# EAGLE design Hornet ODU_1 (EAGLE 9.6.2)
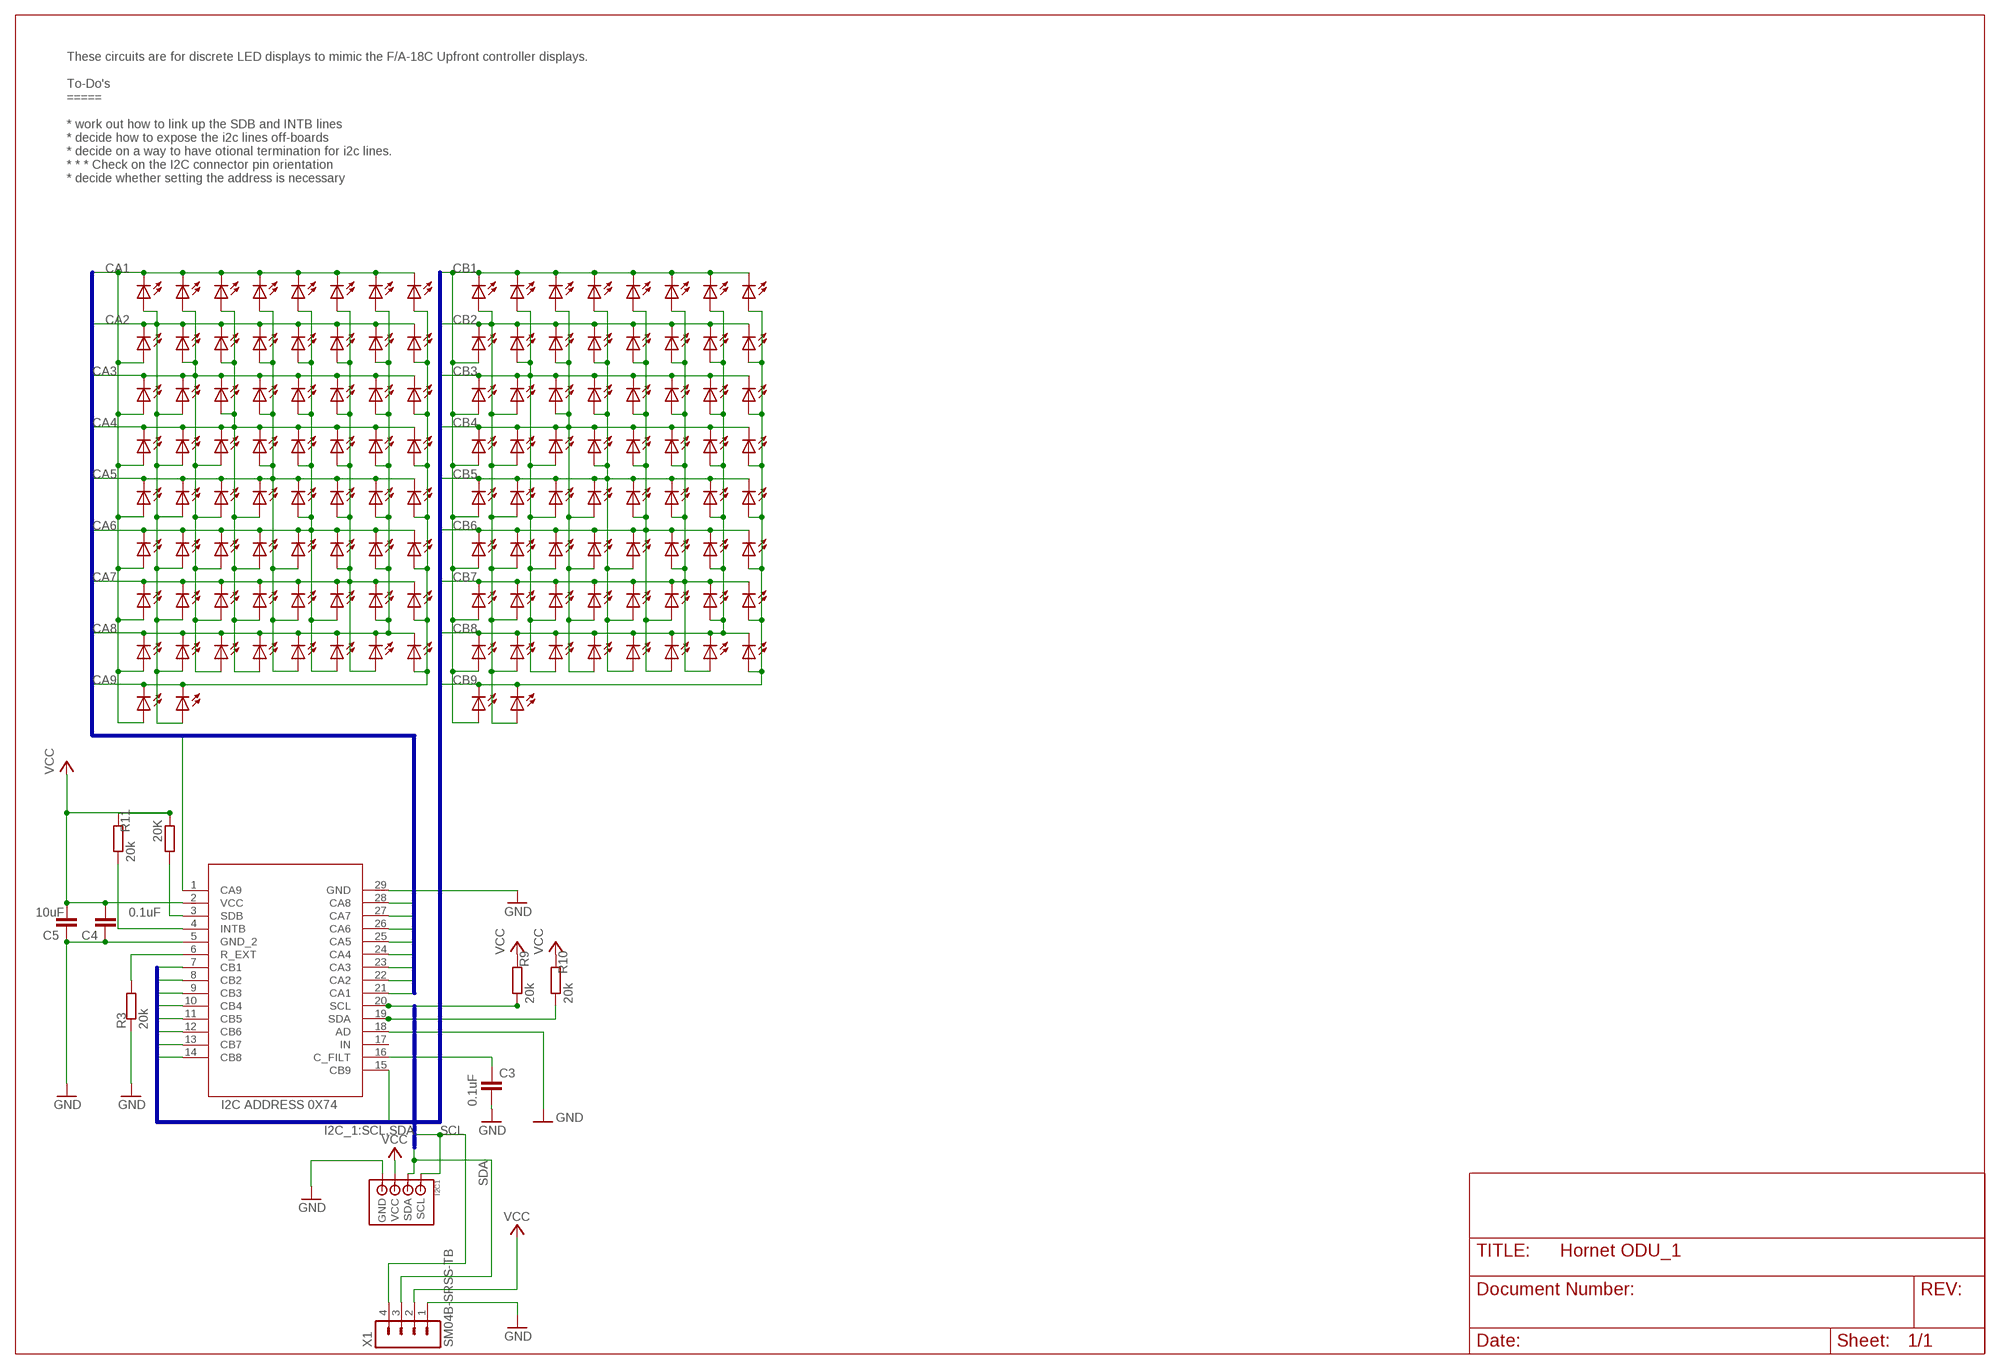
[diagram p0: schematic, sheet 1]

## Parts
C3  0.1uF  C-EUC0805  [C0805]
C4  0.1uF  C-EUC0805  [C0805]
C5  10uF  C-EUC0805  [C0805]
I2C1  I2C_STEMMA_JST_PH_CONNECTORB4B-PH_STEMMA_I2C  [B4B-PH-SOLDER]
LED_A5  LEDSMT0603_1  [CHIPLED_0603]
LED_A6  LEDSMT0603_1  [CHIPLED_0603]
LED_A7  LEDSMT0603_1  [CHIPLED_0603]
LED_A8  LEDSMT0603_1  [CHIPLED_0603]
LED_A9  LEDSMT0603_1  [CHIPLED_0603]
LED_A10  LEDSMT0603_1  [CHIPLED_0603]
LED_A11  LEDSMT0603_1  [CHIPLED_0603]
LED_A12  LEDSMT0603_1  [CHIPLED_0603]
LED_B5  LEDSMT0603_1  [CHIPLED_0603]
LED_B6  LEDSMT0603_1  [CHIPLED_0603]
LED_B7  LEDSMT0603_1  [CHIPLED_0603]
LED_B8  LEDSMT0603_1  [CHIPLED_0603]
LED_B9  LEDSMT0603_1  [CHIPLED_0603]
LED_B10  LEDSMT0603_1  [CHIPLED_0603]
LED_B11  LEDSMT0603_1  [CHIPLED_0603]
LED_B12  LEDSMT0603_1  [CHIPLED_0603]
LED_C5  LEDSMT0603_1  [CHIPLED_0603]
LED_C6  LEDSMT0603_1  [CHIPLED_0603]
LED_C7  LEDSMT0603_1  [CHIPLED_0603]
LED_C8  LEDSMT0603_1  [CHIPLED_0603]
LED_C9  LEDSMT0603_1  [CHIPLED_0603]
LED_C10  LEDSMT0603_1  [CHIPLED_0603]
LED_C11  LEDSMT0603_1  [CHIPLED_0603]
LED_C12  LEDSMT0603_1  [CHIPLED_0603]
LED_D5  LEDSMT0603_1  [CHIPLED_0603]
LED_D6  LEDSMT0603_1  [CHIPLED_0603]
LED_D7  LEDSMT0603_1  [CHIPLED_0603]
LED_D8  LEDSMT0603_1  [CHIPLED_0603]
LED_D9  LEDSMT0603_1  [CHIPLED_0603]
LED_D10  LEDSMT0603_1  [CHIPLED_0603]
LED_D11  LEDSMT0603_1  [CHIPLED_0603]
LED_D12  LEDSMT0603_1  [CHIPLED_0603]
LED_E5  LEDSMT0603_1  [CHIPLED_0603]
LED_E6  LEDSMT0603_1  [CHIPLED_0603]
LED_E7  LEDSMT0603_1  [CHIPLED_0603]
LED_E8  LEDSMT0603_1  [CHIPLED_0603]
LED_E9  LEDSMT0603_1  [CHIPLED_0603]
LED_E10  LEDSMT0603_1  [CHIPLED_0603]
LED_E11  LEDSMT0603_1  [CHIPLED_0603]
LED_E12  LEDSMT0603_1  [CHIPLED_0603]
LED_F5  LEDSMT0603_1  [CHIPLED_0603]
LED_F6  LEDSMT0603_1  [CHIPLED_0603]
LED_F7  LEDSMT0603_1  [CHIPLED_0603]
LED_F8  LEDSMT0603_1  [CHIPLED_0603]
LED_F9  LEDSMT0603_1  [CHIPLED_0603]
LED_F10  LEDSMT0603_1  [CHIPLED_0603]
LED_F11  LEDSMT0603_1  [CHIPLED_0603]
LED_F12  LEDSMT0603_1  [CHIPLED_0603]
LED_G5  LEDSMT0603_1  [CHIPLED_0603]
LED_G6  LEDSMT0603_1  [CHIPLED_0603]
LED_G7  LEDSMT0603_1  [CHIPLED_0603]
LED_G8  LEDSMT0603_1  [CHIPLED_0603]
LED_G9  LEDSMT0603_1  [CHIPLED_0603]
LED_G10  LEDSMT0603_1  [CHIPLED_0603]
LED_G11  LEDSMT0603_1  [CHIPLED_0603]
LED_G12  LEDSMT0603_1  [CHIPLED_0603]
LED_H5  LEDSMT0603_1  [CHIPLED_0603]
LED_H6  LEDSMT0603_1  [CHIPLED_0603]
LED_H7  LEDSMT0603_1  [CHIPLED_0603]
LED_H8  LEDSMT0603_1  [CHIPLED_0603]
LED_H9  LEDSMT0603_1  [CHIPLED_0603]
LED_H10  LEDSMT0603_1  [CHIPLED_0603]
LED_H11  LEDSMT0603_1  [CHIPLED_0603]
LED_H12  LEDSMT0603_1  [CHIPLED_0603]
LED_K5  LEDSMT0603_1  [CHIPLED_0603]
LED_K6  LEDSMT0603_1  [CHIPLED_0603]
LED_K7  LEDSMT0603_1  [CHIPLED_0603]
LED_K8  LEDSMT0603_1  [CHIPLED_0603]
LED_K9  LEDSMT0603_1  [CHIPLED_0603]
LED_K10  LEDSMT0603_1  [CHIPLED_0603]
LED_K11  LEDSMT0603_1  [CHIPLED_0603]
LED_K12  LEDSMT0603_1  [CHIPLED_0603]
LED_M5  LEDSMT0603_1  [CHIPLED_0603]
LED_M6  LEDSMT0603_1  [CHIPLED_0603]
LED_M7  LEDSMT0603_1  [CHIPLED_0603]
LED_M8  LEDSMT0603_1  [CHIPLED_0603]
LED_M9  LEDSMT0603_1  [CHIPLED_0603]
LED_M10  LEDSMT0603_1  [CHIPLED_0603]
LED_M11  LEDSMT0603_1  [CHIPLED_0603]
LED_M12  LEDSMT0603_1  [CHIPLED_0603]
LED_N5  LEDSMT0603_1  [CHIPLED_0603]
LED_N6  LEDSMT0603_1  [CHIPLED_0603]
LED_N7  LEDSMT0603_1  [CHIPLED_0603]
LED_N8  LEDSMT0603_1  [CHIPLED_0603]
LED_N9  LEDSMT0603_1  [CHIPLED_0603]
LED_N10  LEDSMT0603_1  [CHIPLED_0603]
LED_N11  LEDSMT0603_1  [CHIPLED_0603]
LED_N12  LEDSMT0603_1  [CHIPLED_0603]
LED_P5  LEDSMT0603_1  [CHIPLED_0603]
LED_P6  LEDSMT0603_1  [CHIPLED_0603]
LED_P7  LEDSMT0603_1  [CHIPLED_0603]
LED_P8  LEDSMT0603_1  [CHIPLED_0603]
LED_P9  LEDSMT0603_1  [CHIPLED_0603]
LED_P10  LEDSMT0603_1  [CHIPLED_0603]
LED_P11  LEDSMT0603_1  [CHIPLED_0603]
LED_P12  LEDSMT0603_1  [CHIPLED_0603]
LED_R5  LEDSMT0603_1  [CHIPLED_0603]
LED_R6  LEDSMT0603_1  [CHIPLED_0603]
LED_R7  LEDSMT0603_1  [CHIPLED_0603]
LED_R8  LEDSMT0603_1  [CHIPLED_0603]
LED_R9  LEDSMT0603_1  [CHIPLED_0603]
LED_R10  LEDSMT0603_1  [CHIPLED_0603]
LED_R11  LEDSMT0603_1  [CHIPLED_0603]
LED_R12  LEDSMT0603_1  [CHIPLED_0603]
LED_S5  LEDSMT0603_1  [CHIPLED_0603]
LED_S6  LEDSMT0603_1  [CHIPLED_0603]
LED_S7  LEDSMT0603_1  [CHIPLED_0603]
LED_S8  LEDSMT0603_1  [CHIPLED_0603]
LED_S9  LEDSMT0603_1  [CHIPLED_0603]
LED_S10  LEDSMT0603_1  [CHIPLED_0603]
LED_S11  LEDSMT0603_1  [CHIPLED_0603]
LED_S12  LEDSMT0603_1  [CHIPLED_0603]
LED_SEL3  LEDSMT0603_1  [CHIPLED_0603]
LED_SEL4  LEDSMT0603_1  [CHIPLED_0603]
LED_SEL5  LEDSMT0603_1  [CHIPLED_0603]
LED_SEL6  LEDSMT0603_1  [CHIPLED_0603]
LED_T5  LEDSMT0603_1  [CHIPLED_0603]
LED_T6  LEDSMT0603_1  [CHIPLED_0603]
LED_T7  LEDSMT0603_1  [CHIPLED_0603]
LED_T8  LEDSMT0603_1  [CHIPLED_0603]
LED_T9  LEDSMT0603_1  [CHIPLED_0603]
LED_T10  LEDSMT0603_1  [CHIPLED_0603]
LED_T11  LEDSMT0603_1  [CHIPLED_0603]
LED_T12  LEDSMT0603_1  [CHIPLED_0603]
LED_U5  LEDSMT0603_1  [CHIPLED_0603]
LED_U6  LEDSMT0603_1  [CHIPLED_0603]
LED_U7  LEDSMT0603_1  [CHIPLED_0603]
LED_U8  LEDSMT0603_1  [CHIPLED_0603]
LED_U9  LEDSMT0603_1  [CHIPLED_0603]
LED_U10  LEDSMT0603_1  [CHIPLED_0603]
LED_U11  LEDSMT0603_1  [CHIPLED_0603]
LED_U12  LEDSMT0603_1  [CHIPLED_0603]
R3  20k  R-EU_R0805  [R0805]
R6  20K  R-EU_R0805  [R0805]
R9  20k  R-EU_R0805  [R0805]
R10  20k  R-EU_R0805  [R0805]
R11  20k  R-EU_R0805  [R0805]
U1  IS31FL3731C-QFLS2-TR  [QFN-28_ISI]
X1  SM04B-SRSS-TB  [SM04B-SRSS-TB]

## Nets
CA1: LED_A5.C LED_A6.A LED_A7.A LED_A8.A LED_B5.C LED_C5.C LED_D5.C LED_E5.C LED_F5.C LED_G5.C LED_H5.C LED_K5.A LED_K6.A LED_K7.A LED_K8.A LED_SEL3.A U1.21(CA1)
CA2: LED_A5.A LED_B6.A LED_B7.A LED_B8.A LED_K5.C LED_M5.C LED_M6.A LED_M7.A LED_M8.A LED_N5.C LED_P5.C LED_R5.C LED_S5.C LED_SEL4.A LED_T5.C LED_U5.C U1.22(CA2)
CA3: LED_A6.C LED_B5.A LED_B6.C LED_C6.C LED_C7.A LED_C8.A LED_D6.C LED_E6.C LED_F6.C LED_G6.C LED_H6.C LED_M5.A LED_N6.A LED_N7.A LED_N8.A U1.23(CA3)
CA4: LED_C5.A LED_C6.A LED_D7.A LED_D8.A LED_K6.C LED_M6.C LED_N5.A LED_N6.C LED_P6.C LED_P7.A LED_P8.A LED_R6.C LED_S6.C LED_T6.C LED_U6.C U1.24(CA4)
CA5: LED_A7.C LED_B7.C LED_C7.C LED_D5.A LED_D6.A LED_D7.C LED_E7.C LED_E8.A LED_F7.C LED_G7.C LED_H7.C LED_P5.A LED_P6.A LED_R7.A LED_R8.A U1.25(CA5)
CA6: LED_E5.A LED_E6.A LED_E7.A LED_F8.A LED_K7.C LED_M7.C LED_N7.C LED_P7.C LED_R5.A LED_R6.A LED_R7.C LED_S7.C LED_S8.A LED_T7.C LED_U7.C U1.26(CA6)
CA7: LED_A8.C LED_B8.C LED_C8.C LED_D8.C LED_E8.C LED_F5.A LED_F6.A LED_F7.A LED_F8.C LED_G8.C LED_H8.C LED_S5.A LED_S6.A LED_S7.A LED_T8.A U1.27(CA7)
CA8: LED_G5.A LED_G6.A LED_G7.A LED_G8.A LED_K8.C LED_M8.C LED_N8.C LED_P8.C LED_R8.C LED_S8.C LED_T5.A LED_T6.A LED_T7.A LED_T8.C LED_U8.C U1.28(CA8)
CA9: LED_H5.A LED_H6.A LED_H7.A LED_H8.A LED_SEL3.C LED_SEL4.C LED_U5.A LED_U6.A LED_U7.A LED_U8.A U1.1(CA9)
CB1: LED_A9.C LED_A10.A LED_A11.A LED_A12.A LED_B9.C LED_C9.C LED_D9.C LED_E9.C LED_F9.C LED_G9.C LED_H9.C LED_K9.A LED_K10.A LED_K11.A LED_K12.A LED_SEL5.A U1.7(CB1)
CB2: LED_A9.A LED_B10.A LED_B11.A LED_B12.A LED_K9.C LED_M9.C LED_M10.A LED_M11.A LED_M12.A LED_N9.C LED_P9.C LED_R9.C LED_S9.C LED_SEL6.A LED_T9.C LED_U9.C U1.8(CB2)
CB3: LED_A10.C LED_B9.A LED_B10.C LED_C10.C LED_C11.A LED_C12.A LED_D10.C LED_E10.C LED_F10.C LED_G10.C LED_H10.C LED_M9.A LED_N10.A LED_N11.A LED_N12.A U1.9(CB3)
CB4: LED_C9.A LED_C10.A LED_D11.A LED_D12.A LED_K10.C LED_M10.C LED_N9.A LED_N10.C LED_P10.C LED_P11.A LED_P12.A LED_R10.C LED_S10.C LED_T10.C LED_U10.C U1.10(CB4)
CB5: LED_A11.C LED_B11.C LED_C11.C LED_D9.A LED_D10.A LED_D11.C LED_E11.C LED_E12.A LED_F11.C LED_G11.C LED_H11.C LED_P9.A LED_P10.A LED_R11.A LED_R12.A U1.11(CB5)
CB6: LED_E9.A LED_E10.A LED_E11.A LED_F12.A LED_K11.C LED_M11.C LED_N11.C LED_P11.C LED_R9.A LED_R10.A LED_R11.C LED_S11.C LED_S12.A LED_T11.C LED_U11.C U1.12(CB6)
CB7: LED_A12.C LED_B12.C LED_C12.C LED_D12.C LED_E12.C LED_F9.A LED_F10.A LED_F11.A LED_F12.C LED_G12.C LED_H12.C LED_S9.A LED_S10.A LED_S11.A LED_T12.A U1.13(CB7)
CB8: LED_G9.A LED_G10.A LED_G11.A LED_G12.A LED_K12.C LED_M12.C LED_N12.C LED_P12.C LED_R12.C LED_S12.C LED_T9.A LED_T10.A LED_T11.A LED_T12.C LED_U12.C U1.14(CB8)
CB9: LED_H9.A LED_H10.A LED_H11.A LED_H12.A LED_SEL5.C LED_SEL6.C LED_U9.A LED_U10.A LED_U11.A LED_U12.A U1.15(CB9)
GND [POWER]: C3.2 C4.1 C5.1 I2C1.P1(GND) R3.2 U1.5(GND_2) U1.18(AD) U1.29(GND) X1.1
N$3: R3.1 U1.6(R_EXT)
N$4: C3.1 U1.16(C_FILT)
N$7: R6.2 U1.3(SDB)
N$13: R11.2 U1.4(INTB)
SCL: I2C1.P4(SCL) R9.2 U1.20(SCL) X1.4
SDA: I2C1.P3(SDA) R10.2 U1.19(SDA) X1.3
VCC [POWER]: C4.2 C5.2 I2C1.P2(VCC) R6.1 R9.1 R10.1 R11.1 U1.2(VCC) X1.2
Unconnected: U1.17(IN)

## Buses
ODU2:CB1,CB2,CB3,CB4,CB5,CB6,CB7,CB8,CB9
ODU1:CA1,CA2,CA3,CA4,CA5,CA6,CA7,CA8,CA9
I2C_1:SCL,SDA

## Notes on the sheet
- These circuits are for discrete LED displays to mimic the F/A-18C Upfront controller displays.  
  
  To-Do's
  =====
  
  * work out how to link up the SDB and INTB lines
  * decide how to expose the i2c lines off-boards
  * decide on a way to have otional termination for i2c lines.
  * * * Check on the I2C connector pin orientation
  * decide whether setting the address is necessary
- I2C ADDRESS 0X74

## Library data of the parts
C3-C5 = rcl:C-EU: CAPACITOR, European symbol; SPICEPREFIX: C
I2C1 = 000_nl2:I2C_STEMMA_JST_PH_CONNECTOR
LED_A5-LED_A12 LED_B5-LED_B12 LED_C5-LED_C12 LED_D5-LED_D12 LED_E5-LED_E12 LED_F5-LED_F12 LED_G5-LED_G12 LED_H5-LED_H12 LED_K5-LED_K12 LED_M5-LED_M12 LED_N5-LED_N12 LED_P5-LED_P12 LED_R5-LED_R12 LED_S5-LED_S12 LED_SEL3-LED_SEL6 LED_T5-LED_T12 LED_U5-LED_U12 = 000_nl2:LED: LED KINGBRIGHT: KPTL-3216 are the reverse LEDs Source: www.kingbright.com
R3 R6 R9-R11 = rcl:R-EU_: RESISTOR, European symbol; SPICEPREFIX: R
U1 = 000_nl2:IS31FL3731C-QFLS2-TR; BUILT_BY: EMA_Cory; COPYRIGHT: Copyright (C) 2018 Accelerated Designs. All rights reserved; DATASHEET: http://www.issi.com/WW/pdf/31FL3731.pdf; MANUFACTURER_PART_NUMBER: IS31FL3731C-QFLS2-TR; SOURCELIBRARY: ISSI_2020-07-08; VENDOR: ISSI
X1 = con-JST SH:SM04B-SRSS: JST SH series header 1.00mm pitch disconnectable crimp style connectors, horizontal (side entry type), 4 pins

## Net classes
3 POWER: width 0.254 mm

## Board
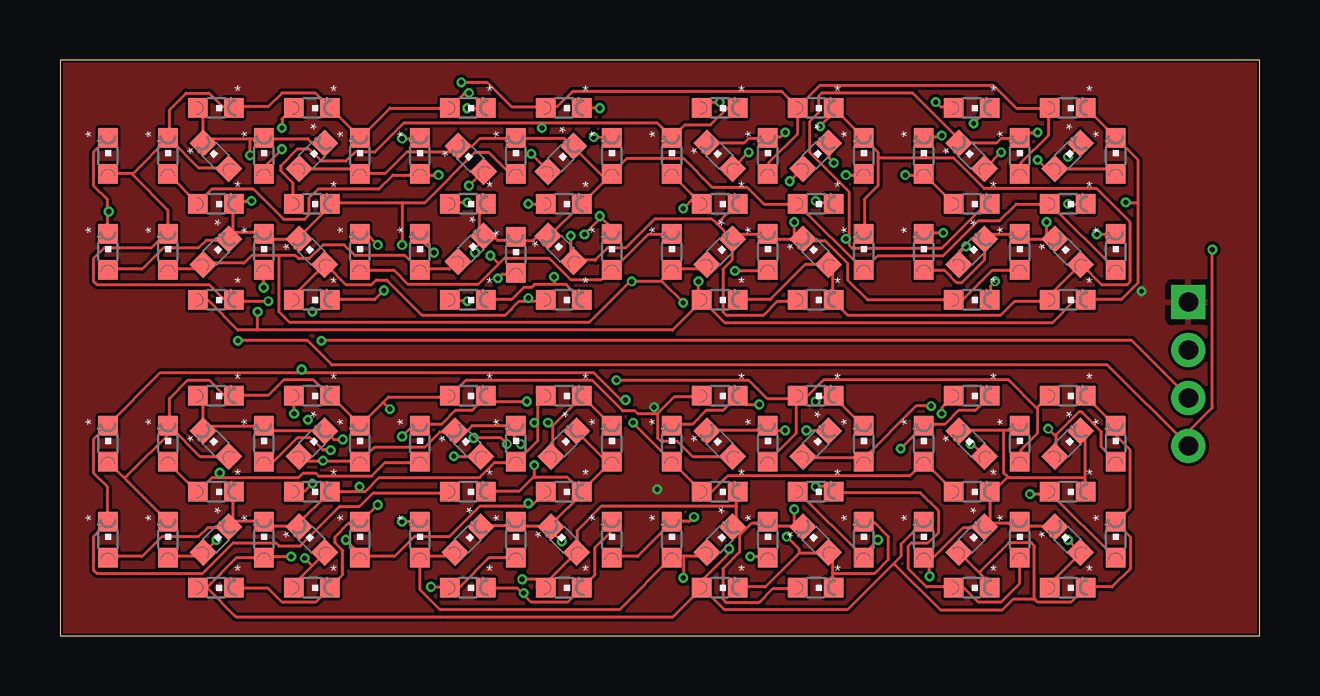
[diagram p1: board, top side]
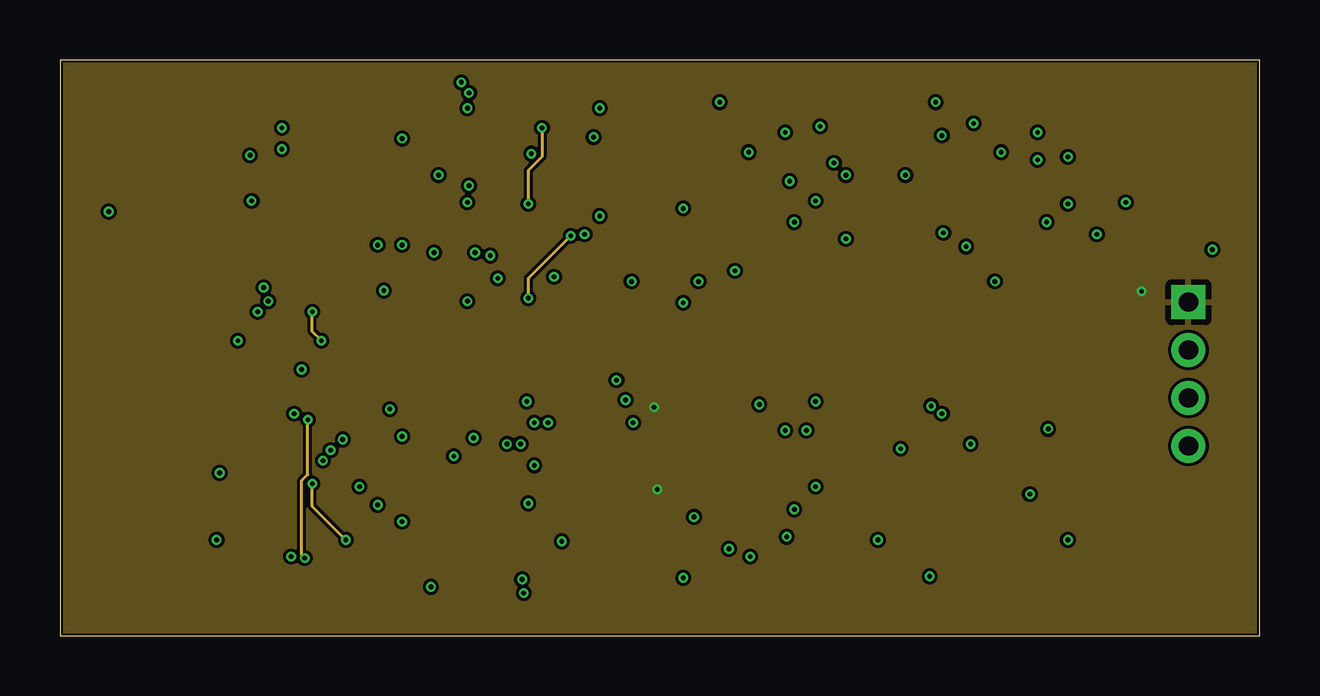
[diagram p2: board, inner layer Route2]
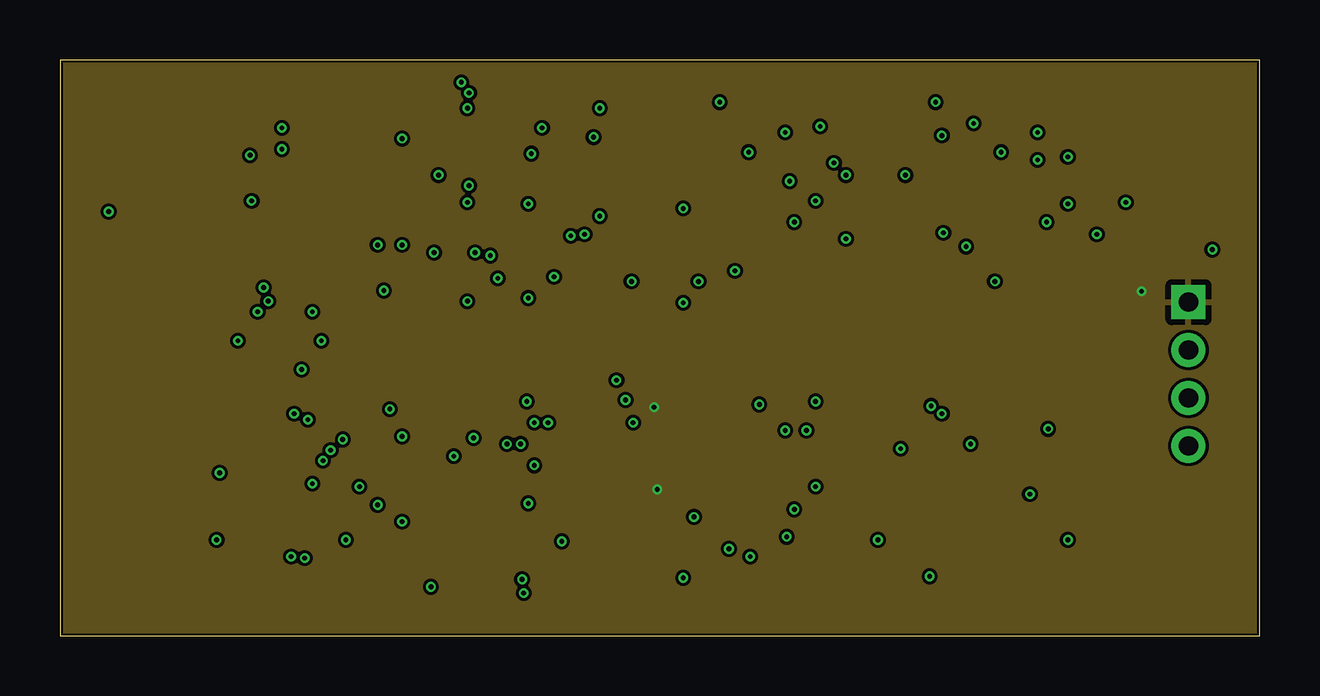
[diagram p3: board, inner layer Route15]
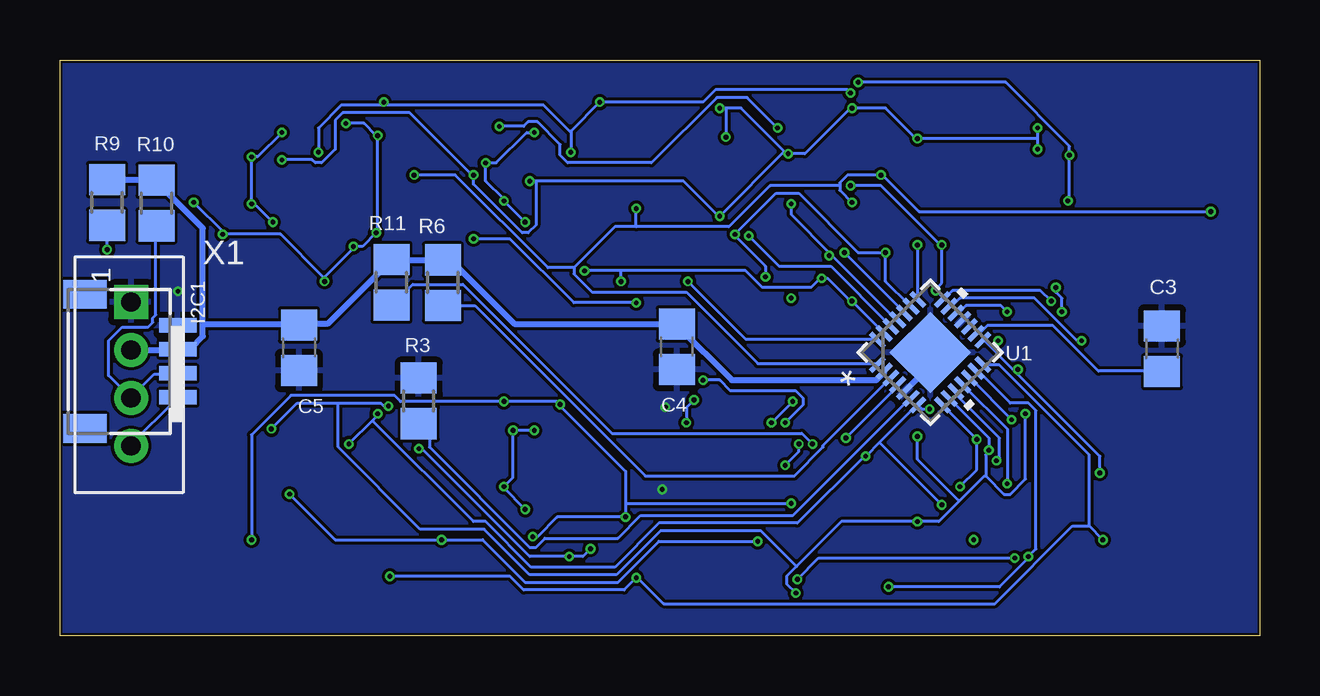
[diagram p4: board, bottom side, seen from below]

Size 50 x 24 mm. Coordinates in mm from the lower left corner, seen from the top.
Outline: 0,0 50,0 50,24 0,24 0,0
Copper layers (1*2*15*16): Top 0.035559375mm / dielectric 0.17018125mm / Route2 0.01778125mm / dielectric 47mil / Route15 0.01778125mm / dielectric 0.17018125mm / Bottom 0.035559375mm
Design rules "jlcpcb-4-layer": minimum track width 5mil, minimum drill 0.2mm, track to track 0.126490625mm, track to pad 0.126490625mm, pad to pad 0.126490625mm, via to via 0.126490625mm, smd to smd 0mil, copper to edge 0.1mm, drill to drill 5mil, minimum pad ring 4mil, minimum via ring 4mil, stop-mask expansion 3mil, vias tented up to drill 100mil, thermal gap 10mil

### Footprints (pad centres in the part's own frame; a part is rotated, then mirrored left to right if it is on the bottom)
C0805 = smd 1.3 x 1.5: 1 -0.95,0; 2 0.95,0
B4B-PH-SOLDER = drill 0.8 pad 1.422 square: P1 -2.98,0.588 | drill 0.8 pad 1.422: P2 -0.98,0.588; P3 1.02,0.588; P4 3.02,0.588
CHIPLED_0603 = smd 0.8 x 0.8: A 0,-0.75; C 0,0.75
R0805 = smd 1.3 x 1.5: 1 -0.95,0; 2 0.95,0
QFN-28_ISI = smd 0.808 x 0.204: 1 -1.915,1.2; 2 -1.915,0.8; 3 -1.915,0.4; 4 -1.915,0; 5 -1.915,-0.4; 6 -1.915,-0.8; 7 -1.915,-1.2; 15 1.915,-1.2; 16 1.915,-0.8; 17 1.915,-0.4; 18 1.915,0; 19 1.915,0.4; 20 1.915,0.8; 21 1.915,1.2 | smd 0.204 x 0.808: 8 -1.2,-1.915; 9 -0.8,-1.915; 10 -0.4,-1.915; 11 0,-1.915; 12 0.4,-1.915; 13 0.8,-1.915; 14 1.2,-1.915; 22 1.2,1.915; 23 0.8,1.915; 24 0.4,1.915; 25 0,1.915; 26 -0.4,1.915; 27 -0.8,1.915; 28 -1.2,1.915 | smd 2.388 x 2.388: 29 0,0
SM04B-SRSS-TB = smd 0.6 x 1.55: 1 1.5,0; 2 0.5,0; 3 -0.5,0; 4 -1.5,0 | smd 1.2 x 1.8: M1 2.8,3.875; M2 -2.8,3.875

### Placement (x,y rotation side)
C3  4.06,11.96 90 bottom
C4  24.29,12.04 90 bottom
C5  40.03,12 90 bottom
I2C1  47.62,10.92 270 bottom
LED_A5  6.5,22 270 top
LED_A6  17,22 270 top
LED_A7  27.5,22 270 top
LED_A8  38,22 270 top
LED_A9  6.5,10 270 top
LED_A10  17,10 270 top
LED_A11  27.5,10 270 top
LED_A12  38,10 270 top
LED_B5  10.5,22 270 top
LED_B6  21,22 270 top
LED_B7  31.5,22 270 top
LED_B8  42,22 270 top
LED_B9  10.5,10 270 top
LED_B10  21,10 270 top
LED_B11  31.5,10 270 top
LED_B12  42,10 270 top
LED_C5  12.5,20 0 top
LED_C6  23,20 0 top
LED_C7  33.5,20 0 top
LED_C8  44,20 0 top
LED_C9  12.5,8 0 top
LED_C10  23,8 0 top
LED_C11  33.5,8 0 top
LED_C12  44,8 0 top
LED_D5  12.5,16 0 top
LED_D6  23,16 0 top
LED_D7  33.5,16 0 top
LED_D8  44,16 0 top
LED_D9  12.5,4 0 top
LED_D10  23,4 0 top
LED_D11  33.5,4 0 top
LED_D12  44,4 0 top
LED_E5  10.5,14 270 top
LED_E6  21,14 270 top
LED_E7  31.5,14 270 top
LED_E8  42,14 270 top
LED_E9  10.5,2 270 top
LED_E10  21,2 270 top
LED_E11  31.5,2 270 top
LED_E12  42,2 270 top
LED_F5  6.5,14 270 top
LED_F6  17,14 270 top
LED_F7  27.5,14 270 top
LED_F8  38,14 270 top
LED_F9  6.5,2 270 top
LED_F10  17,2 270 top
LED_F11  27.5,2 270 top
LED_F12  38,2 270 top
LED_G5  4.5,16 0 top
LED_G6  15,16 0 top
LED_G7  25.5,16 0 top
LED_G8  36,16 0 top
LED_G9  4.5,4 0 top
LED_G10  15,4 0 top
LED_G11  25.5,4 0 top
LED_G12  36,4 0 top
LED_H5  4.5,20 0 top
LED_H6  15,20 0 top
LED_H7  25.5,20 0 top
LED_H8  36,20 0 top
LED_H9  4.5,8 0 top
LED_H10  15,8 0 top
LED_H11  25.5,8 0 top
LED_H12  36,8 0 top
LED_K5  6.5,20 45 top
LED_K6  17.13,19.87 45 top
LED_K7  27.5,20 45 top
LED_K8  38,20 45 top
LED_K9  6.5,8 45 top
LED_K10  17,8 45 top
LED_K11  27.5,8 45 top
LED_K12  38,8 45 top
LED_M5  8.5,20 0 top
LED_M6  19,20 0 top
LED_M7  29.5,20 0 top
LED_M8  40,20 0 top
LED_M9  8.5,8 0 top
LED_M10  19,8 0 top
LED_M11  29.5,8 0 top
LED_M12  40,8 0 top
LED_N5  10.5,20 315 top
LED_N6  20.87,19.87 315 top
LED_N7  31.5,20 315 top
LED_N8  42,20 315 top
LED_N9  10.5,8 315 top
LED_N10  21,8 315 top
LED_N11  31.5,8 315 top
LED_N12  42,8 315 top
LED_P5  10.5,18 270 top
LED_P6  21,18 270 top
LED_P7  31.5,18 270 top
LED_P8  42,18 270 top
LED_P9  10.5,6 270 top
LED_P10  21,6 270 top
LED_P11  31.5,6 270 top
LED_P12  42,6 270 top
LED_R5  10.5,16 45 top
LED_R6  20.87,16.13 45 top
LED_R7  31.5,16 45 top
LED_R8  42,16 45 top
LED_R9  10.5,4 45 top
LED_R10  21,4 45 top
LED_R11  31.5,4 45 top
LED_R12  42,4 45 top
LED_S5  8.5,16 0 top
LED_S6  19,15.87 0 top
LED_S7  29.5,16 0 top
LED_S8  40,16 0 top
LED_S9  8.5,4 0 top
LED_S10  19,4 0 top
LED_S11  29.5,4 0 top
LED_S12  40,4 0 top
LED_SEL3  2,20 0 top
LED_SEL4  2,16 0 top
LED_SEL5  2,8 0 top
LED_SEL6  2,4 0 top
LED_T5  6.5,16 315 top
LED_T6  17.13,16.13 315 top
LED_T7  27.5,16 315 top
LED_T8  38,16 315 top
LED_T9  6.5,4 315 top
LED_T10  17,4 315 top
LED_T11  27.5,4 315 top
LED_T12  38,4 315 top
LED_U5  6.5,18 270 top
LED_U6  17,18 270 top
LED_U7  27.5,18 270 top
LED_U8  38,18 270 top
LED_U9  6.5,6 270 top
LED_U10  17,6 270 top
LED_U11  27.5,6 270 top
LED_U12  38,6 270 top
R3  35.05,9.78 90 bottom
R6  34.04,14.72 270 bottom
R9  48.04,18.06 270 bottom
R10  45.97,18.03 270 bottom
R11  36.18,14.73 270 bottom
U1  13.73,11.81 45 bottom
X1  45.09,11.43 90 bottom

### Tracks (layer width: path | path; a pad name or v marks a point on that pad's centre or on a via)
CA1  (via drill 0.2)
  Top 0.127: v28.71,20.15 28.07,19.52 LED_K7.A | v27.5,22.24 27,22.24 26.81,22.05 LED_A7.A | v39.23,20.15 38.59,19.52 LED_K8.A | v36.5,22.24 36.69,22.05 37.2,22.05 LED_A8.A | v13.5,14.38 13.12,14.01 11.28,14.01 LED_E5.C | v13.24,16.29 12.8,16.73 12.55,16.73 LED_D5.C | v17.05,18.76 17.62,19.33 LED_K6.A | 3.04,19.27 2.03,19.27 LED_SEL3.A | 3.04,19.27 4.5,20.72 LED_H5.C | 3.04,19.27 3.04,19.2 4.5,17.74 4.5,16.79 LED_G5.C 4.44,16.79 3.8,16.16 1.84,16.16 1.39,15.72 1.39,14.77 1.52,14.64 6.21,14.64 6.84,14.01 7.22,14.01 LED_F5.C 7.29,13.94 v8.68,13.94 | LED_K5.A 6.97,19.52 5.77,19.52 4.56,20.72 LED_H5.C | LED_H5.C 4.56,20.79 4.56,21.93 5.26,22.62 6.21,22.62 6.78,22.05 7.22,22.05 LED_A5.C 7.29,22.05 8.68,22.05 9.25,22.62 10.65,22.62 11.22,22.05 LED_B5.C 11.28,21.99 12.48,20.79 LED_C5.C 12.55,20.79 13.75,21.99 16.22,21.99 LED_A6.A 16.29,22.05 16.86,22.62 v17.05,22.62
  Bottom 0.127: 28.71,21.04 v28.71,20.15 | 28.71,21.04 v27.5,22.24 23.19,22.24 22.69,22.75 17.17,22.75 v17.05,22.62 | v39.23,20.15 39.23,21.17 38.28,22.12 36.5,22.12 | 36.5,22.12 29.85,22.12 28.77,21.04 28.71,21.04 | v36.5,22.24 36.5,22.12 | v17.05,18.76 15.78,18.76 13.31,16.29 v13.24,16.29 13.24,14.7 13.5,14.45 v13.5,14.38 13.18,14.07 U1.21 13.12,14.07 12.8,14.38 9.13,14.38 v8.68,13.94
CA2  (via drill 0.2)
  Top 0.127: LED_M8.A 40.05,19.27 40.05,19.71 41.19,20.85 41.19,21.99 LED_B8.A 41.13,21.99 39.86,21.99 38.91,22.94 31.69,22.94 30.8,22.05 LED_B7.A | LED_B7.A 30.73,22.05 30.1,22.69 21.36,22.69 20.72,22.05 20.28,22.05 LED_B6.A 20.22,22.05 18.82,22.05 17.81,23.07 v16.73,23.07 | LED_M7.A 29.53,19.27 29.53,19.71 30.73,20.91 30.73,21.99 LED_B7.A | LED_A5.A 5.77,21.99 5.96,21.8 5.96,20.53 LED_K5.C 6.02,20.72 7.92,20.72 | 7.92,20.72 8.49,20.72 LED_M5.C 8.55,20.72 10.33,20.72 10.52,20.53 LED_N5.C | LED_SEL4.A 2.03,15.27 3.42,15.27 4.31,16.16 5.77,16.16 6.08,16.48 6.97,16.48 LED_T5.C | LED_T5.C 7.22,16.73 7.22,18 LED_U5.C 7.29,18.06 7.35,18.12 v7.99,18.12 | v7.92,20.03 7.92,20.72 | 14.26,18.06 11.28,18.06 LED_P5.C 11.22,18 11.22,17.87 9.95,16.6 LED_R5.C 9.95,16.54 8.74,16.54 8.55,16.73 LED_S5.C 8.49,16.79 7.29,16.79 LED_T5.C | 14.26,18.06 15.21,18.06 17.3,20.15 17.87,20.15 18.76,19.27 18.95,19.27 LED_M6.A | 14.26,18.06 v14.26,16.29
  Bottom 0.127: v7.99,18.12 7.92,18.19 v7.92,20.03 7.92,20.41 10.58,23.07 v16.73,23.07 | v14.26,16.29 14.26,14.07 U1.22
CA3  (via drill 0.2)
  Top 0.127: 20.6,14.64 21.1,14.64 21.74,14.01 LED_E6.C | 20.6,14.64 19.77,14.64 19.64,14.51 19.33,14.51 18.82,14.01 17.81,14.01 LED_F6.C | v15.59,15.97 15.02,16.54 15.02,16.73 LED_G6.C | LED_C8.A 43.98,19.27 43.79,19.45 41.51,19.45 LED_N8.A 41.45,19.52 41.06,19.52 v40.75,19.84 | v9.25,20.28 8.55,19.58 8.55,19.27 LED_M5.A | v9.25,21.17 9.25,21.55 9.7,21.99 LED_B5.A | v14.26,20.72 14.96,20.72 LED_H6.C | v16.98,21.99 LED_A6.C | v19.64,20.09 20.34,19.39 LED_N6.A | v22.5,21.99 21.8,21.99 LED_B6.C | 22.56,17.43 22.94,17.05 22.94,16.79 LED_D6.C | v22.24,20.79 22.94,20.79 LED_C6.C | v30.42,18.95 30.93,19.45 LED_N7.A | v32.76,19.2 33.46,19.2 LED_C7.A | 22.56,17.43 v21.86,16.73 | 22.56,17.43 v22.5,17.49 | v20.6,14.96 20.6,14.64
  Bottom 0.127: U1.23 14.58,13.75 15.59,14.77 v15.59,15.97 16.73,15.97 19.2,18.44 20.15,18.44 v21.86,16.73 21.86,16.67 20.6,15.4 v20.6,14.96 | v9.25,21.17 9.25,20.72 | 9.25,20.72 v9.25,20.28 | 9.25,20.72 v14.26,20.72 14.32,20.72 15.59,21.99 v16.98,21.99 17.05,21.99 18.95,20.09 v19.64,20.09 | 22.24,21.99 21.61,21.99 19.71,20.09 v19.64,20.09 | 22.24,21.99 v22.5,21.99 | v19.64,20.09 19.84,20.15 v22.5,17.49 22.56,17.49 24.02,18.95 30.16,18.95 | 22.24,21.99 v22.24,20.79 | 30.16,18.95 v30.42,18.95 | 30.16,18.95 30.16,17.11 30.48,16.79 30.73,16.79 32.76,18.82 v32.76,19.2 32.83,19.2 35.42,21.8 38.21,21.8 38.53,21.48 38.53,20.28 39.1,19.71 39.35,19.71 39.48,19.84 v40.75,19.84
CA4  (via drill 0.2)
  Top 0.127: LED_N5.A 10.01,19.45 12.29,19.45 12.48,19.27 LED_C5.A 12.55,19.27 13.56,19.27 14.45,20.15 16.35,20.15 16.54,20.34 LED_K6.C 17.17,20.41 17.49,20.72 18.95,20.72 LED_M6.C 19.01,20.72 21.04,20.72 21.36,20.41 LED_N6.C 21.42,20.34 22.75,19.01 | LED_D8.A 43.98,15.27 LED_P8.A 41.19,18 39.86,18 39.16,17.3 38.28,17.3 36.82,15.84 34.09,15.84 33.52,15.27 LED_D7.A 33.46,15.27 30.73,18 LED_P7.A 30.67,18 29.34,18 28.64,18.7 27.19,18.7 25.98,19.9 23.64,19.9 23,19.27 LED_C6.A | 22.75,19.01 22.94,19.2 LED_C6.A | 22.75,19.01 21.8,18.06 LED_P6.C 21.74,18 20.41,16.67 LED_R6.C 20.34,16.6 19.84,16.6 19.71,16.48 19.14,16.48 19.01,16.6 LED_S6.C 18.95,16.6 18.82,16.48 18.25,16.48 18.12,16.6 17.68,16.6 LED_T6.C | 22.75,19.01 LED_C6.A | LED_U6.C 17.74,17.81 17.49,17.55 17.49,16.79 17.62,16.67 LED_T6.C | v17.3,15.97 17.3,16.16 17.68,16.54 LED_T6.C
  Bottom 0.127: v17.3,15.97 14.83,13.5 U1.24
CA5  (via drill 0.2)
  Top 0.127: 34.09,19.9 34.09,20.15 33.52,20.72 LED_C7.C 33.46,20.79 LED_B7.C 32.32,21.86 v31.69,21.23 | 34.09,19.9 34.09,18.76 33.52,18.19 33.52,16.79 LED_D7.C | LED_F7.C 28.26,14.01 29.59,14.01 31.05,15.46 32,15.46 LED_R7.A 32,15.4 32.19,15.21 32.19,14.01 LED_E7.C 32.26,13.94 32.83,13.37 39.23,13.37 39.8,13.94 41.19,13.94 LED_E8.A 41.26,14.2 LED_R8.A 42.59,15.46 43.41,14.64 44.49,14.64 44.61,14.77 44.61,17.24 43.22,18.63 38.53,18.63 37.26,19.9 34.09,19.9 | v19.52,18 20.22,18 LED_P6.A | 18.28,15.49 18.5,15.72 20.41,15.72 21.29,14.83 22.56,14.83 22.94,15.21 LED_D6.A 23,15.21 24.52,16.73 25.48,16.73 LED_G7.C | 18.28,15.49 17.43,14.64 14.51,14.64 13.94,15.21 12.55,15.21 LED_D5.A | v17.93,15.84 18.25,15.53 18.28,15.49 | 20.09,21.36 24.91,21.36 25.48,20.79 LED_H7.C 25.54,20.79 26.05,21.29 27.12,21.29 27.82,21.99 28.2,21.99 LED_A7.C | 20.09,21.36 14.32,21.36 13.12,20.15 12.29,20.15 11.91,19.77 10.9,19.77 10.39,20.28 9.89,20.28 9.19,19.58 9.19,19.39 9.7,18.89 9.7,18.06 LED_P5.A | 20.09,21.36 v20.09,21.17
  Route2 0.127: v19.52,18 19.52,19.39 20.09,19.96 v20.09,21.17
  Bottom 0.127: v19.52,18 19.52,17.55 17.84,15.88 | 17.84,15.88 15.15,13.18 U1.25 | v17.93,15.84 17.87,15.84 17.84,15.88 | v31.69,21.23 30.67,21.23 30.48,21.42 30.1,21.42 29.15,20.47 29.15,20.03 28.83,19.71 25.35,19.71 22.62,22.43 21.36,22.43 v20.09,21.17
CA6  (via drill 0.2)
  Top 0.127: LED_S8.A 39.99,15.21 38.85,15.21 37.64,14.01 37.26,14.01 LED_F8.A 37.2,14.01 33.65,14.01 32.83,14.83 32.83,15.53 31.88,16.48 30.99,16.48 LED_R7.C | LED_K7.C 27,20.53 28.52,20.53 28.71,20.72 29.47,20.72 LED_M7.C 29.53,20.79 30.04,20.79 v30.23,20.98 | LED_R7.C 30.93,16.54 29.72,16.54 29.53,16.73 LED_S7.C 29.47,16.73 28.26,16.73 28.07,16.54 LED_T7.C | v31.5,18.12 31.56,18.06 32.19,18.06 LED_P7.C | v30.61,17.24 30.61,16.6 LED_R7.C | v32.26,19.71 32.07,19.9 32.07,20.47 LED_N7.C | LED_E5.A 9.76,14.2 LED_R5.A 11.09,15.46 11.91,14.64 12.99,14.64 13.18,14.83 13.62,14.83 15.08,13.37 18.57,13.37 19.14,13.94 19.52,13.94 | 19.52,13.94 20.22,13.94 LED_E6.A | 27.38,17.17 28.01,16.54 LED_T7.C | 27.38,17.17 27.19,17.36 24.78,17.36 23.57,16.16 22.81,16.16 22.31,15.65 21.42,15.65 LED_R6.A 21.42,15.72 21.29,15.84 v21.29,16.67 | LED_E7.A 30.73,13.94 29.91,13.94 29.34,13.37 27.76,13.37 27.63,13.5 27.63,15.27 28.01,15.65 28.01,16.48 LED_T7.C | 27.38,17.17 28.2,18 LED_U7.C | v19.52,14.07 19.52,13.94
  Route2 0.127: v19.52,14.07 19.52,14.89 v21.29,16.67
  Bottom 0.127: v30.61,17.24 v31.5,18.12 31.5,18.19 32.26,18.95 v32.26,19.71 31.81,19.71 30.55,20.98 v30.23,20.98 | v21.29,16.67 20.03,15.4 17.87,15.4 15.4,12.93 U1.26
CA7  (via drill 0.2)
  Top 0.127: v16.98,13.94 16.29,13.94 LED_F6.A | v18.25,14.89 18.44,15.08 18.95,15.08 LED_S6.A | v28.14,15.21 29.47,15.21 LED_S7.A | 44.93,18.06 44.93,19.84 44.04,20.72 LED_C8.C 43.98,20.79 42.78,21.99 LED_B8.C | 44.93,18.06 44.93,14.7 44.23,14.01 42.78,14.01 LED_E8.C 42.71,13.94 42.27,13.94 41.38,13.05 27.69,13.05 26.81,13.94 LED_F7.A | v37.77,16.22 37.52,15.97 37.52,15.53 LED_T8.A | v36.82,16.79 36.06,16.79 LED_G8.C | v38.97,14.77 38.78,14.58 38.78,14.01 LED_F8.C | v36.76,20.85 36.69,20.79 36.06,20.79 LED_H8.C | v43.22,16.73 43.98,16.73 LED_D8.C | v38.09,21.36 38.72,21.99 LED_A8.C | v44.42,18.06 44.93,18.06 | 8.24,12.74 25.54,12.74 26.74,13.94 LED_F7.A | 8.24,12.74 7.42,12.74 6.21,13.94 5.77,13.94 LED_F5.A | v8.49,14.51 8.49,15.21 LED_S5.A | 8.24,12.74 v8.24,13.5 | v26.62,14.77 26.62,14.13 LED_F7.A
  Bottom 0.127: U1.27 15.65,12.61 v16.98,13.94 17.05,13.94 18,14.89 v18.25,14.89 18.31,14.89 18.7,14.51 20.72,14.51 21.42,15.21 26.62,15.21 | 26.62,15.21 v28.14,15.21 | v38.09,21.36 37.33,21.36 36.82,20.85 v36.76,20.85 36.76,16.79 v36.82,16.79 37.39,16.22 v37.77,16.22 37.77,16.16 38.97,14.96 v38.97,14.77 39.04,14.96 40.81,16.73 v43.22,16.73 43.16,16.79 v44.42,18.06 | v8.49,14.51 8.49,14.32 8.24,14.07 v8.24,13.5 | v26.62,14.77 26.62,15.21
CA8  (via drill 0.2)
  Top 0.127: LED_G8.A 36.06,15.21 36.88,15.21 37.39,14.7 37.58,14.7 38.53,15.65 38.53,16.48 LED_T8.C 38.59,16.54 38.78,16.73 39.99,16.73 LED_S8.C 40.05,16.73 40.24,16.54 41.45,16.54 LED_R8.C 41.13,16.6 v41.13,17.24 | v42.02,18 42.71,18 LED_P8.C | v42.02,19.96 42.52,20.47 LED_N8.C | 32.89,16.54 32.89,18.5 31.24,20.15 31.24,21.42 31.62,21.8 31.62,22.5 31.75,22.62 35.55,22.62 37.58,20.6 LED_K8.C 37.52,20.53 39.04,20.53 39.23,20.72 39.99,20.72 LED_M8.C 40.05,20.79 40.24,20.98 v40.75,20.98 | 32.89,16.54 32.89,16.29 33.02,16.16 36.76,16.16 38.59,18 38.72,18 LED_U8.C | LED_G5.A 4.56,15.27 5.77,15.27 5.96,15.46 LED_T5.A 6.02,15.53 7.67,15.53 7.99,15.84 9.13,15.84 | LED_T6.A 16.54,15.59 16.22,15.27 15.02,15.27 LED_G6.A 14.96,15.27 14.38,15.84 12.29,15.84 11.85,16.29 10.96,16.29 10.39,15.72 9.95,15.72 9.82,15.84 9.13,15.84 | LED_T7.A 26.93,15.46 26.74,15.27 25.54,15.27 LED_G7.A 25.48,15.21 25.03,14.77 | 25.03,14.77 v23.83,14.77 23.76,14.77 22.05,13.05 9.57,13.05 9.13,13.5 9.13,15.84 | v25.98,13.88 25.09,14.77 25.03,14.77 | v32.76,16.54 32.89,16.54
  Bottom 0.127: v41.13,17.24 41.89,18 v42.02,18 v42.02,19.96 41.76,19.96 v40.75,20.98 | v23.83,14.77 21.42,12.36 15.97,12.36 U1.28 | v32.76,16.54 31.24,16.54 28.58,13.88 v25.98,13.88
CA9  (via drill 0.2)
  Top 0.127: 1.97,17.68 1.97,18.19 1.39,18.76 1.39,20.15 1.97,20.72 LED_SEL3.C | 1.97,17.68 1.97,16.79 LED_SEL4.C | LED_U8.A 37.2,18.06 36.06,19.2 LED_H8.A 35.99,19.2 v35.23,19.2 | LED_H7.A 25.54,19.2 LED_U7.A 26.43,18.25 v25.98,17.81 | LED_H5.A 4.56,19.2 5.7,18.06 LED_U5.A 5.77,18.06 6.34,18.63 8.05,18.63 9.32,17.36 10.2,17.36 10.39,17.55 10.39,18.25 10.77,18.63 13.31,18.63 13.88,19.2 14.96,19.2 LED_H6.A 15.02,19.2 v15.78,19.2 | v16.98,18.06 16.29,18.06 LED_U6.A | v2.03,17.68 1.97,17.68
  Bottom 0.127: v16.98,18.06 17.49,18.57 17.49,18.76 | 17.49,18.76 17.49,18.89 17.17,19.2 v15.78,19.2 15.72,19.2 14.2,17.68 v2.03,17.68 | 28.58,15.34 28.58,15.08 27.82,14.32 23.89,14.32 20.91,11.34 15.97,11.34 U1.1 | 28.58,15.34 26.87,17.05 25.98,17.05 | 25.98,17.05 22.12,17.05 20.41,18.76 17.49,18.76 | 25.98,17.05 v25.98,17.81 | v35.23,19.2 33.52,19.2 29.66,15.34 28.58,15.34
CB1  (via drill 0.2)
  Top 0.127: 2.69,6.56 2.03,7.22 LED_SEL5.A | 2.69,6.56 LED_G9.C | LED_K9.A 6.97,7.48 5.83,7.48 4.56,8.74 LED_H9.C | LED_H9.C 4.56,8.81 4.56,9.89 5.32,10.65 6.21,10.65 6.84,10.01 7.22,10.01 LED_A9.C 7.29,10.01 8.68,10.01 9.32,10.65 10.58,10.65 11.22,10.01 LED_B9.C 11.28,10.01 12.48,8.81 LED_C9.C 12.55,8.81 13.47,9.73 | 2.69,6.56 2.73,6.59 4.69,8.55 LED_H9.C | 24.91,9.25 24.91,8.24 25.03,8.11 25.73,8.11 26.36,7.48 28.01,7.48 LED_K11.A | 24.91,9.25 25.6,9.95 26.74,9.95 LED_A11.A | 13.47,9.73 13.69,9.95 16.22,9.95 LED_A10.A 16.29,10.01 16.92,10.65 22.18,10.65 23.45,9.38 23.95,9.38 24.08,9.25 24.91,9.25 | LED_F9.C 7.29,1.97 8.68,1.97 9.25,1.39 10.65,1.39 11.22,1.97 LED_E9.C 11.28,2.03 11.79,2.54 11.79,3.55 11.47,3.87 11.47,4.12 12.04,4.69 12.48,4.69 LED_D9.C 12.55,4.75 v13.24,5.45 | v37.96,7.99 38.02,7.99 LED_K12.A | v36.76,9.25 36.76,9.51 37.2,9.95 LED_A12.A | v16.41,7.48 17.49,7.48 LED_K10.A | v13.75,9.44 13.5,9.7 13.47,9.73
  Bottom 0.127: 36.98,8.97 36.76,9.19 v36.76,9.25 | 36.98,8.97 v37.96,7.99 | 15.84,8.05 14.26,9.63 U1.7 14.2,9.57 14.07,9.44 v13.75,9.44 | 15.84,8.05 v16.41,7.48 16.48,7.48 19.27,4.69 25.03,4.69 26.87,2.85 30.36,2.85 32.26,4.75 32.76,4.75 36.95,8.94 36.98,8.97 | 15.84,8.05 v13.24,5.45
CB2  (via drill 0.2)
  Top 0.127: LED_M11.A 29.53,7.29 30.67,8.43 30.67,9.89 30.73,9.95 LED_B11.A | 40.75,9.51 40.75,8.43 40.05,7.73 40.05,7.29 LED_M12.A | 40.75,9.51 41.19,9.95 LED_B12.A | LED_B11.A 30.8,10.01 31.18,10.01 31.81,10.65 39.54,10.65 40.69,9.51 40.75,9.51 | LED_A9.A 5.77,9.95 5.96,9.76 5.96,8.55 LED_K9.C 6.02,8.74 LED_M9.C 8.55,8.74 8.74,8.55 11.03,8.55 LED_N9.C 11.09,8.49 11.41,8.18 v11.79,8.18 | LED_SEL6.A 2.03,3.29 3.42,3.29 4.25,4.12 5.77,4.12 6.15,4.5 6.97,4.5 LED_T9.C | LED_U9.C 7.22,5.96 7.22,4.75 7.03,4.56 LED_T9.C | 19.9,8.87 19.9,9.63 20.22,9.95 LED_B10.A | 19.9,8.87 19.9,8.11 19.33,7.54 19.27,7.54 19.01,7.29 LED_M10.A 18.95,7.22 18.12,7.22 17.49,6.59 13.31,6.59 12.74,6.02 12.48,6.02 | 12.48,6.02 11.28,6.02 LED_P9.C 11.22,5.96 9.89,4.63 LED_R9.C 9.95,4.56 8.68,4.56 8.55,4.69 LED_S9.C 7.29,4.75 LED_T9.C | 12.48,6.02 v12.48,6.21 | v23.19,10.65 28.71,10.65 29.47,9.89 30.61,9.89 LED_B11.A | v19.77,8.87 19.9,8.87
  Bottom 0.127: U1.8 13.18,9.57 v11.79,8.18 11.79,6.91 v12.48,6.21 | v23.19,10.65 22.5,10.65 22.05,10.2 19.33,10.2 19.01,9.89 19.01,9.63 v19.77,8.87
CB3  (via drill 0.2)
  Top 0.127: LED_N11.A 30.99,7.42 33.33,7.42 33.46,7.29 LED_C11.A 33.46,7.35 35.68,9.57 v36.31,9.57 | 41.51,8.37 41.51,7.48 LED_N12.A | 41.51,8.37 42.46,9.32 42.59,9.32 43.41,8.49 43.41,7.86 43.98,7.29 LED_C12.A | v41.19,8.62 41.45,8.37 41.51,8.37 | 19.3,1.74 19.64,1.39 21.17,1.39 21.74,1.97 LED_E10.C 21.8,2.03 22.31,2.54 22.31,3.68 22.94,4.31 22.94,4.69 LED_D10.C | 19.3,1.74 19.07,1.97 17.81,1.97 LED_F10.C | 20.53,8.74 20.53,7.48 LED_N10.A | 20.53,8.74 21.74,9.95 LED_B10.C 21.8,9.95 22.94,8.81 LED_C10.C | v11.28,7.73 10.96,7.73 10.46,8.24 9.89,8.24 8.94,7.29 8.55,7.29 LED_M9.A | v9.76,9.25 9.76,9.95 LED_B9.A | v14.26,4.75 14.96,4.75 LED_G10.C | v14.26,8.3 14.7,8.74 14.96,8.74 LED_H10.C 15.02,8.81 15.91,8.81 16.48,9.38 17.17,9.38 17.74,9.95 LED_A10.C 17.81,9.95 18,9.76 v19.45,9.76 | v20.34,8.87 20.47,8.74 20.53,8.74 | v19.33,1.77 19.3,1.74
  Bottom 0.127: v36.31,9.57 36.5,9.57 36.63,9.7 38.4,9.7 | 38.4,9.7 40.11,9.7 v41.19,8.62 | U1.9 12.93,9.89 11.28,8.24 v11.28,7.73 11.28,7.67 11.41,7.54 11.41,6.65 | v9.76,9.25 9.76,6.53 10.39,5.89 10.65,5.89 11.41,6.65 | 12.52,5.61 11.47,6.65 11.41,6.65 | 12.52,5.61 13.37,4.75 v14.26,4.75 17.43,4.75 19.3,2.88 | v14.26,8.3 14.26,7.35 12.55,5.64 12.52,5.61 | v19.45,9.76 v20.34,8.87 | v19.33,1.77 19.71,2.15 19.71,2.47 19.3,2.88 | 38.4,9.7 38.4,7.86 34.98,4.44 32.32,4.44 30.42,2.54 26.81,2.54 24.97,4.37 20.79,4.37 19.33,2.92 19.3,2.88
CB4  (via drill 0.2)
  Top 0.127: LED_N9.A 10.01,7.42 10.14,7.29 v10.96,7.29 12.48,7.29 LED_C9.A 12.55,7.29 13.12,7.86 15.21,7.86 15.84,8.49 16.41,8.49 LED_K10.C 16.48,8.55 16.98,8.55 17.17,8.74 18.95,8.74 LED_M10.C 18.95,8.68 18.95,8.24 v19.2,7.99 | LED_T10.C 17.55,4.56 18.82,4.56 18.95,4.69 LED_S10.C 19.01,4.69 19.14,4.56 20.47,4.56 LED_R10.C | 19.77,6.59 21.17,6.59 21.74,6.02 | 19.77,6.59 19.71,6.59 19.14,6.02 17.81,6.02 LED_U10.C | 21.74,6.02 22.88,7.16 | 22.88,7.16 22.94,7.22 LED_C10.A 22.88,7.16 | 21.74,6.02 LED_P10.C 21.8,5.96 20.47,4.63 LED_R10.C | 22.88,7.16 21.55,8.49 LED_N10.C | LED_P11.A 30.8,5.96 33.46,3.29 LED_D11.A 33.46,3.36 v34.09,3.99 | LED_D12.A 43.98,3.23 41.26,5.96 LED_P12.A 41.26,5.89 v40.43,5.89 | v20.91,3.93 20.53,4.31 20.53,4.5 LED_R10.C | 19.77,6.59 v19.77,7.1
  Bottom 0.127: v10.96,7.29 10.84,7.42 10.84,8.24 12.61,10.01 12.61,10.14 U1.10 | v40.43,5.89 38.53,3.99 v34.09,3.99 32.38,3.99 30.61,2.22 26.74,2.22 25.03,3.93 v20.91,3.93 | v19.2,7.99 19.2,7.67 v19.77,7.1
CB5  (via drill 0.2)
  Top 0.127: v10.52,6.34 10.2,6.02 9.76,6.02 LED_P9.A | 19.52,5.39 19.64,5.39 20.22,5.96 LED_P10.A | 19.52,5.39 17.49,5.39 16.22,4.12 14.77,4.12 13.94,3.29 12.55,3.29 LED_D9.A 12.55,3.36 v11.91,3.99 | 30.8,3.42 29.41,2.03 28.26,2.03 LED_F11.C | 30.8,3.42 32,3.42 LED_R11.A 32,3.36 32.19,3.17 32.19,2.6 | 32.19,2.6 32.19,2.03 LED_E11.C | 32.19,2.6 33.97,2.6 34.54,3.17 34.54,4.12 33.97,4.69 33.52,4.69 LED_D11.C | LED_D10.A 23,3.29 24.08,3.29 25.48,4.69 LED_G11.C 25.54,4.75 26.24,4.75 v26.43,4.94 | LED_E12.A 41.26,2.03 41.26,2.15 42.52,3.42 LED_R12.A 42.52,3.48 v42.02,3.99 | LED_C11.C 33.46,8.74 32.26,9.95 LED_B11.C 32.19,9.95 31.69,9.95 v31.5,9.76 | LED_H11.C 25.54,8.81 26.36,8.81 26.93,9.38 27.63,9.38 28.2,9.95 LED_A11.C 28.26,9.95 28.58,9.63 v29.15,9.63 | 30.8,3.42 30.8,3.61 v30.29,4.12 | v19.52,5.51 19.52,5.39
  Route2 0.127: v10.52,6.34 10.52,5.39 v11.91,3.99
  Bottom 0.127: v10.52,6.34 10.52,8.62 12.36,10.46 U1.11 | v42.02,3.99 42.02,8.37 40.37,10.01 36.06,10.01 35.8,9.76 v31.5,9.76 29.28,9.76 v29.15,9.63 29.15,9.57 26.43,6.84 26.43,5.51 | 26.43,5.51 v26.43,4.94 29.28,4.94 30.1,4.12 v30.29,4.12 | 26.43,5.51 v19.52,5.51
CB6  (via drill 0.2)
  Top 0.127: LED_K11.C 27,8.55 29.28,8.55 29.47,8.74 LED_M11.C 29.53,8.74 29.72,8.55 v30.23,8.55 | v31.12,8.55 32,8.55 LED_N11.C | LED_S12.A 39.99,3.23 39.99,2.15 39.23,1.39 38.28,1.39 37.71,1.97 37.26,1.97 LED_F12.A 37.2,2.03 36.12,2.03 35.36,2.79 35.36,3.74 35.49,3.87 36.19,3.87 36.63,4.31 36.63,5.2 35.87,5.96 32.26,5.96 LED_P11.C 32.19,6.02 32,6.21 v31.5,6.21 | 10.52,2.92 11.03,3.42 LED_R9.A | 10.52,2.92 9.76,2.15 9.76,2.03 LED_E9.A | 10.52,2.92 v10.2,3.23 | 28.33,4.25 28.33,3.48 27.63,2.79 27.63,1.52 27.76,1.39 29.15,1.39 29.72,1.97 30.73,1.97 LED_E11.A | 28.33,4.25 28.07,4.5 LED_T11.C 28.07,4.56 28.2,4.69 28.2,5.39 | 28.33,4.25 28.39,4.25 28.83,4.69 29.47,4.69 LED_S11.C 29.53,4.69 29.66,4.56 30.93,4.56 LED_R11.C 30.61,4.63 v30.61,5.26 | 28.2,5.39 28.2,5.96 LED_U11.C | 28.2,5.39 22.56,5.39 21.55,4.37 21.55,3.48 LED_R10.A 21.48,3.42 20.28,2.22 20.28,2.03 LED_E10.A 20.22,2.22 20.09,2.35 v19.27,2.35
  Route2 0.127: v10.33,9 10.33,6.72 10.08,6.46 10.08,3.36 v10.2,3.23
  Bottom 0.127: v30.23,8.55 v31.12,8.55 31.12,6.59 v31.5,6.21 31.5,6.15 v30.61,5.26 | v10.33,9 12.04,10.71 U1.12 | v10.2,3.23 18.38,3.23 v19.27,2.35
CB7  (via drill 0.2)
  Top 0.127: LED_S10.A 18.95,3.23 17.87,3.23 16.67,2.03 16.29,2.03 LED_F10.A 16.22,2.03 v15.46,2.03 | v9.63,3.29 8.55,3.29 LED_S9.A 8.49,3.23 7.35,3.23 6.15,2.03 5.77,2.03 LED_F9.A 6.15,1.97 7.35,0.76 25.54,0.76 26.74,1.97 LED_F11.A | 38.31,2.63 37.52,3.42 LED_T12.A | 38.31,2.63 38.72,2.22 38.72,2.03 LED_F12.C | LED_B12.C 42.78,9.95 43.98,8.74 LED_C12.C 43.98,8.68 43.98,8.37 44.61,7.73 44.61,5.32 44.04,4.75 LED_D12.C 44.04,4.69 44.61,4.12 44.61,2.79 43.85,2.03 42.78,2.03 LED_E12.C 42.71,1.97 42.14,1.39 40.75,1.39 40.62,1.52 | 40.62,1.52 40.62,3.74 40.49,3.87 39.54,3.87 38.34,2.66 38.31,2.63 | LED_A12.C 38.72,9.95 38.15,9.38 37.45,9.38 36.88,8.81 36.06,8.81 LED_H12.C v35.05,7.79 | 34.76,3.01 35.05,3.29 35.05,3.8 LED_G12.C | 34.76,3.01 32.83,1.08 27.69,1.08 26.81,1.97 LED_F11.A | v28.77,3.29 29.47,3.29 LED_S11.A | v27.88,3.61 27.88,3.42 26.81,2.35 26.81,2.03 LED_F11.A | 40.62,1.52 39.73,1.52 39.29,1.08 36.69,1.08 34.79,2.98 34.76,3.01
  Bottom 0.127: U1.13 11.79,10.96 11.66,10.96 10.39,9.7 9.63,9.7 9.32,9.38 9.32,3.61 v9.63,3.29 9.63,3.23 10.84,2.03 v15.46,2.03 | v27.88,3.61 28.2,3.29 v28.77,3.29 30.42,3.29 34.92,7.79 v35.05,7.79
CB8  (via drill 0.2)
  Top 0.127: LED_G9.A 4.56,3.29 5.83,3.29 5.96,3.42 LED_T9.A 6.02,3.48 v6.53,3.99 | 39.35,8.55 39.8,8.55 39.99,8.74 LED_M12.C | 39.35,8.55 37.52,8.55 LED_K12.C | 42.71,6.59 42.71,8.37 42.59,8.49 LED_N12.C | 42.71,6.59 42.71,6.02 LED_P12.C | LED_T12.C 38.53,4.5 37.64,4.5 36.44,3.29 36.06,3.29 LED_G12.A 36.25,3.23 v36.25,2.47 | LED_T12.C 38.59,4.56 38.72,4.69 39.99,4.69 LED_S12.C 40.05,4.69 40.18,4.56 41.45,4.56 LED_R12.C | LED_T12.C 38.78,4.75 38.78,5.96 LED_U12.C 38.85,5.96 39.48,6.59 | 39.48,6.59 42.71,6.59 | 39.35,8.55 39.35,6.78 39.48,6.65 39.48,6.59 | LED_T10.A 16.41,3.42 16.29,3.29 15.02,3.29 LED_G10.A 15.02,3.23 15.02,1.9 15.84,1.08 23.32,1.08 25.48,3.23 LED_G11.A 25.54,3.29 25.98,3.29 | 25.98,3.29 26.81,3.29 26.93,3.42 LED_T11.A | 25.98,3.29 v25.98,2.41
  Bottom 0.127: 7.1,4.56 7.1,7.54 10.84,11.28 11.47,11.28 U1.14 | v6.53,3.99 7.1,4.56 | v36.25,2.47 31.24,2.47 30.67,1.9 26.49,1.9 v25.98,2.41 25.92,2.41 24.84,1.33 11.03,1.33 7.79,4.56 7.1,4.56
CB9  (via drill 0.2)
  Top 0.127: LED_H9.A 4.5,7.22 5.7,6.02 LED_U9.A 5.77,6.02 6.34,6.59 6.65,6.59 | 6.65,6.59 9.95,6.59 10.14,6.78 10.65,6.78 10.77,6.65 12.99,6.65 13.56,7.22 14.96,7.22 LED_H10.A | 6.65,6.59 v6.65,6.78 | LED_U12.A 37.26,6.02 36.06,7.22 LED_H12.A 35.99,7.22 35.42,6.65 27.82,6.65 27.19,6.02 26.81,6.02 LED_U11.A 26.74,6.02 25.54,7.22 LED_H11.A 25.48,7.29 v23.89,8.87 | LED_U10.A 16.22,5.96 13.05,5.96 12.48,5.39 11.66,5.39 10.01,3.74 9.13,3.74 9,3.87 7.22,3.87 5.96,2.6 1.52,2.6 1.39,2.73 1.39,4.12 1.97,4.69 LED_SEL6.C 1.97,4.75 1.97,6.21 1.39,6.78 1.39,8.18 1.97,8.74 LED_SEL5.C 2.03,8.81 4.18,10.96 10.08,10.96 | v23.57,9.82 23.38,9.82 22.24,10.96 10.08,10.96 | v10.08,11.09 10.08,10.96
  Bottom 0.127: 10.17,10.99 6.65,7.48 v6.65,6.78 | 10.17,10.99 11.47,12.29 U1.15 | v23.89,8.87 23.89,9.51 v23.57,9.82 | v10.08,11.09 10.14,11.03 10.17,10.99
GND  (via drill 0.2)
  Bottom 0.254: U1.5 13.73,11.24 U1.29
  other vias: 45.09,14.35 24.89,6.1 24.77,9.53
  pour Top: 0,0 50,0 50,24 0,24
  pour Bottom: 0,0 50,0 50,24 0,24
  pour Route2: 0,0 50,0 50,24 0,24
  pour Route15: 0,0 50,0 50,24 0,24
N$3
  Bottom 0.127: U1.6 14.58,9.89 19.45,5.01 25.79,5.01 26.74,4.06 29.79,4.06 30.16,3.68 30.42,3.68 34.6,7.86 34.6,8.37 35.05,8.81 R3.1
N$4
  Bottom 0.127: U1.16 11.79,12.61 11.66,12.61 11.34,12.93 8.62,12.93 6.72,11.03 4.12,11.03 C3.1
N$7
  Bottom 0.127: U1.3 15.4,10.71 18.19,7.92 18.19,7.86 19.39,6.65 25.6,6.65 32.7,13.75 34.03,13.75 R6.2
N$13  (via drill 0.2)
  Top 0.127: v17.24,8.24 18.38,8.24 v18.63,7.99
  Bottom 0.127: v17.24,8.24 15.15,10.33 15.15,10.46 U1.4 | v18.63,7.99 19.07,8.43 27,8.43 33.21,14.64 35.3,14.64 36.12,13.81 R11.2
SCL  (via drill 0.2)
  Top 0.127: v7.42,12.29 10.33,12.29 11.34,11.28 43.66,11.28 47.02,7.92 I2C1.P4 46.77,8.24 48.04,9.51 v48.04,16.1
  Bottom 0.127: v7.42,12.29 7.61,12.29 9.38,14.07 12.48,14.07 12.8,13.75 12.93,13.75 U1.20 | v48.04,16.1 48.04,17.05 R9.2 | X1.4 45.12,9.89 47.09,7.92 I2C1.P4
SDA  (via drill 0.2)
  Top 0.127: v10.9,12.29 44.68,12.29 47.02,9.95 I2C1.P3
  Route2 0.127: v10.52,13.5 10.52,12.67 v10.9,12.29
  Bottom 0.127: v10.52,13.5 10.77,13.75 12.23,13.75 12.48,13.5 12.61,13.5 U1.19 | R10.2 46.01,17.05 46.01,13.37 46.13,13.24 46.13,13.05 46.33,12.86 47.4,12.86 47.97,12.29 47.97,10.84 47.09,9.95 I2C1.P3 47.02,9.95 46.07,10.9 45.12,10.9 X1.3
VCC
  Bottom 0.254: U1.2 15.65,10.96 15.97,10.65 21.99,10.65 24.27,12.93 C4.2 24.4,12.99 31.05,12.99 33.71,15.65 33.9,15.65 R6.1 34.09,15.65 36.12,15.65 R11.1 36.25,15.59 38.85,12.99 39.99,12.99 C5.2 40.11,12.99 44.04,12.99 | R9.1 46.01,19.01 R10.1 45.95,18.89 44.04,16.98 44.04,12.99 | I2C1.P2 47.02,11.91 45.12,11.91 X1.2 44.99,11.98 44.55,11.98 44.04,12.48 44.04,12.99